# EasyEDA Pro project ProProject_Orin Adapter_2025-03-09.epro

# Schematic Schematic1
Create Date: 2024-01-20; Page Name: P1; Project Name: Orin Adapter; Schematic Name: Schematic1; Update Date: 2024-01-22; Company: EasyEDA.com; Drawed: EasyEDA Pro; Page Size: A4; Part Number: JLCPCB-002; Reviewed: EasyEDA Pro; Version: V0.1
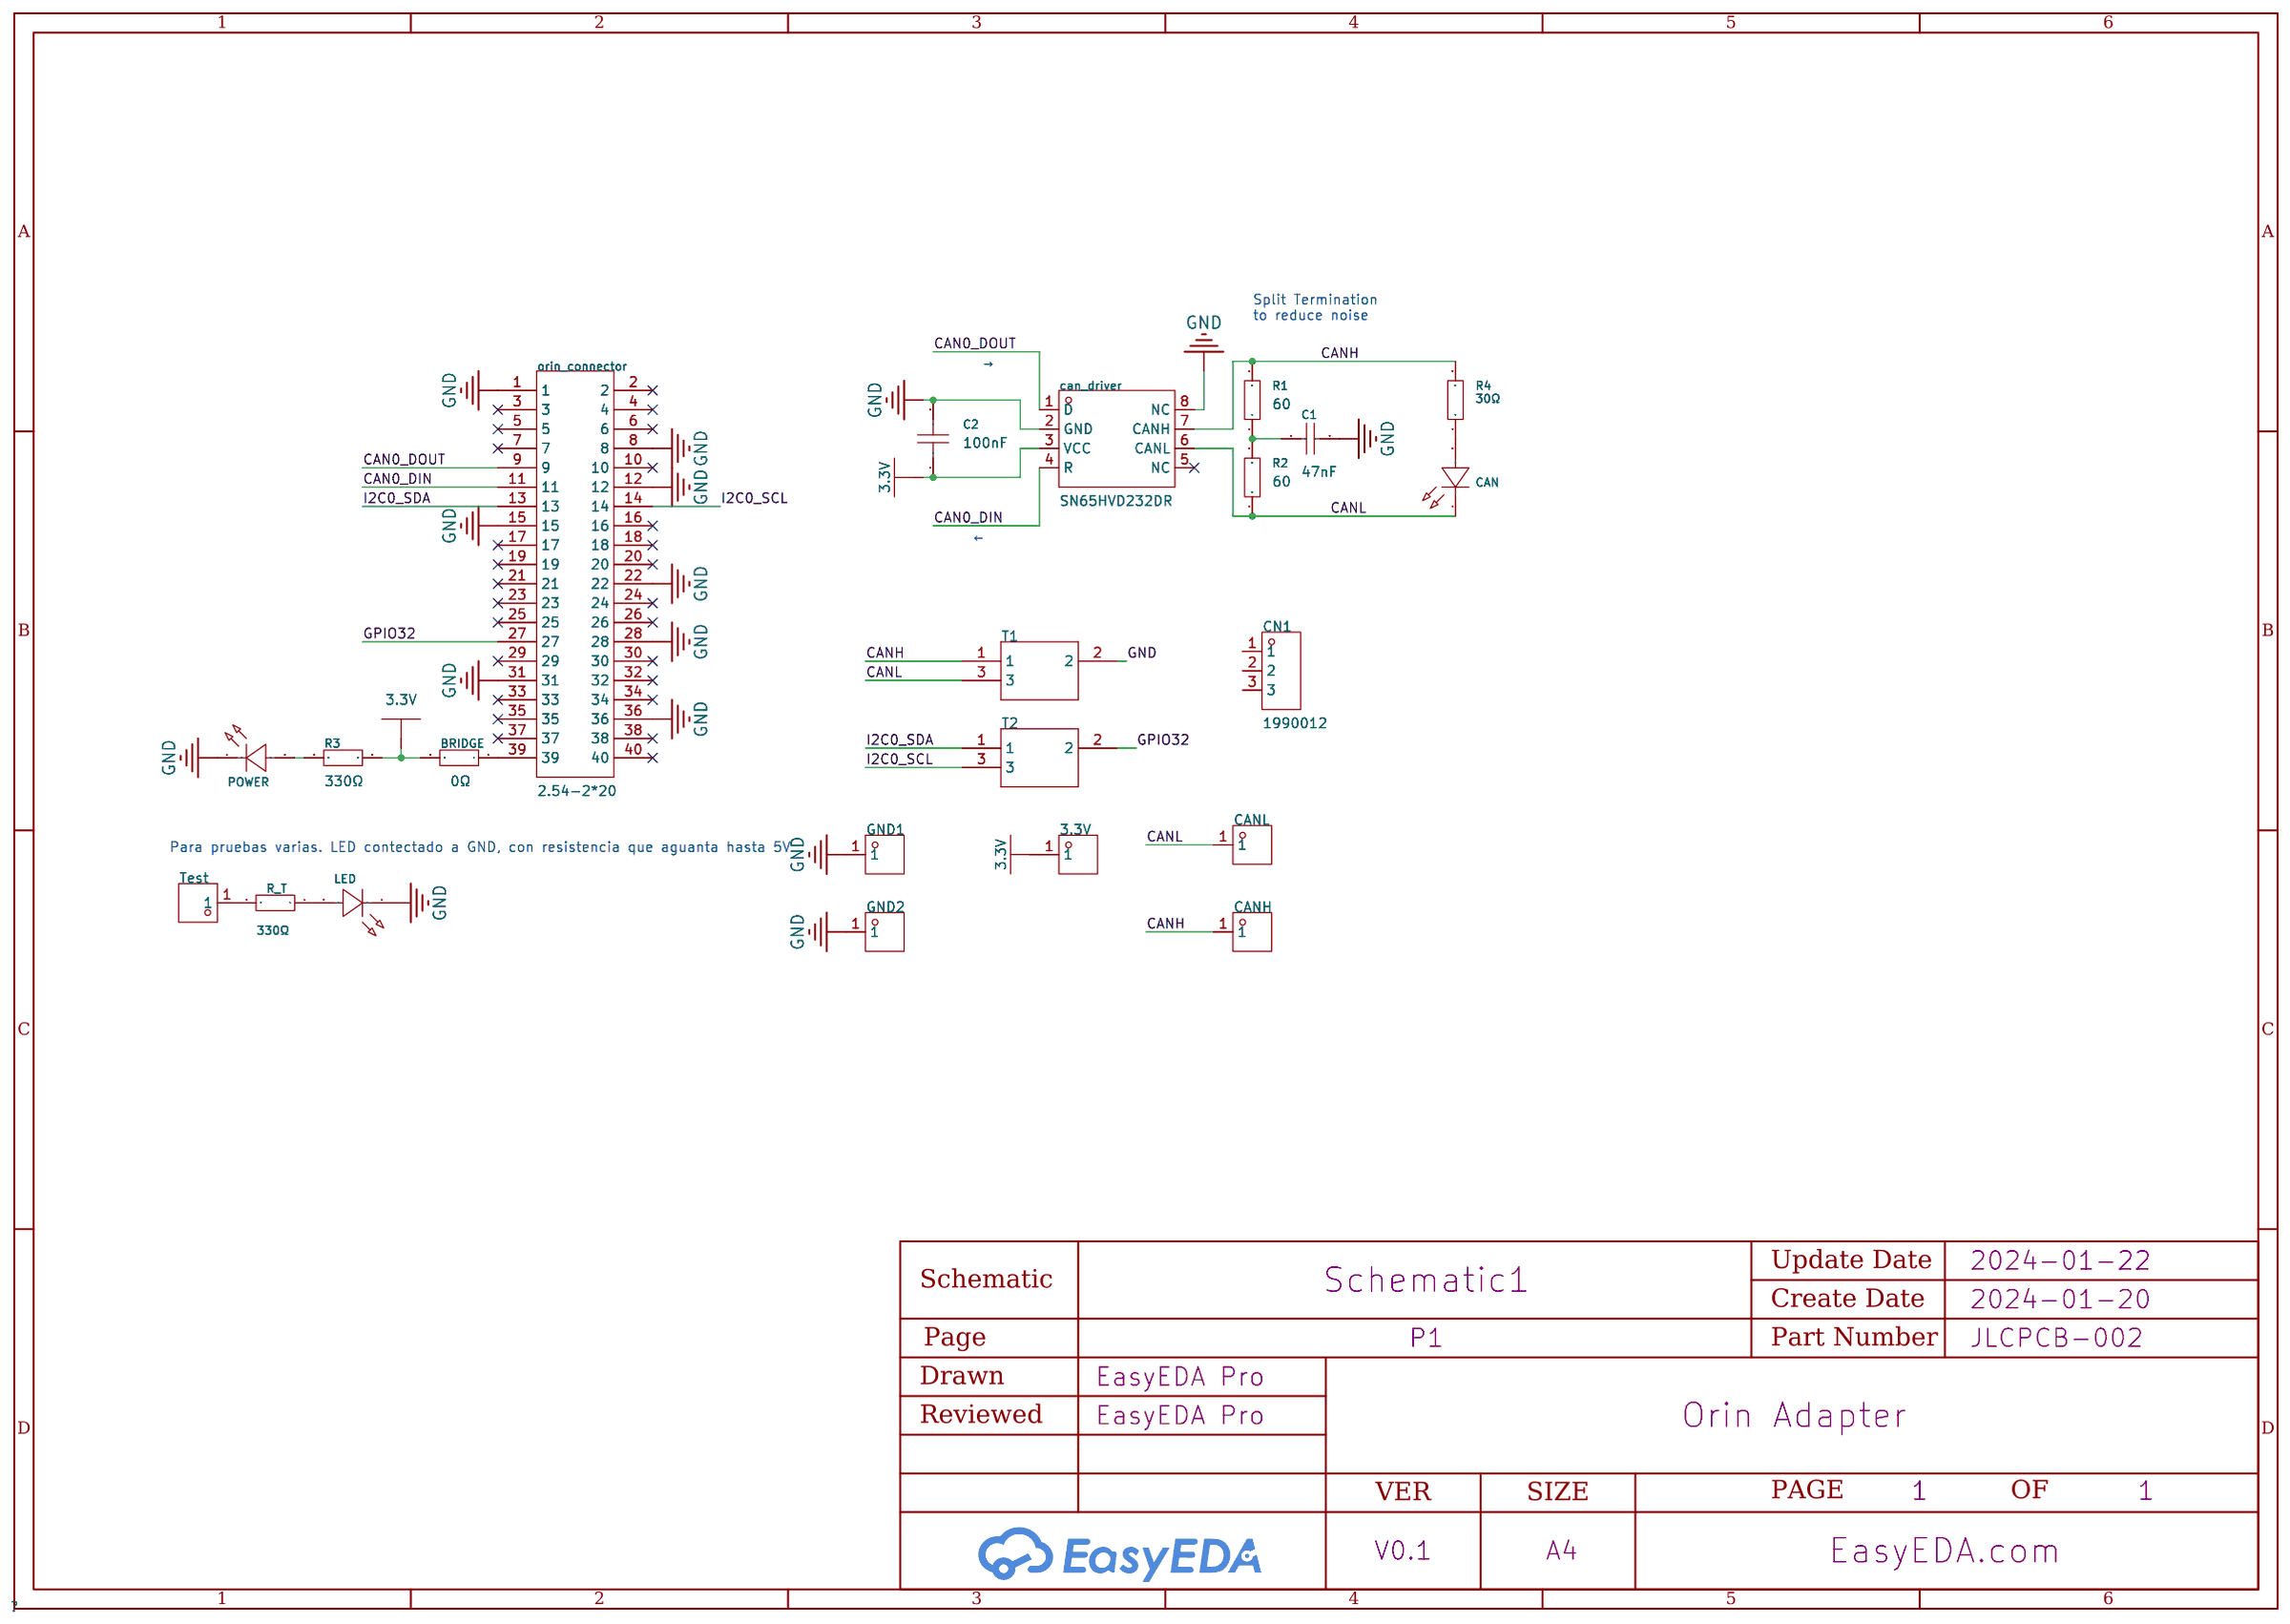
[diagram p0: schematic sheet]

## Parts
3.3V  5-146868-1  [HDR-TH_1P-P2.54-V-M_1]
BRIDGE  0Ω  [R0603]
C1  47nF  [C0603]
C2  100nF  [C0603]
CAN  150060GS75000  [LED0603-RD_GREEN]
can_driver  SN65HVD232DR  [SOIC-8_L5.0-W4.0-P1.27-LS6.0-BL]
CANH  5-146868-1  [HDR-TH_1P-P2.54-V-M_1]
CANL  5-146868-1  [HDR-TH_1P-P2.54-V-M_1]
CN1  1990012  [CONN-TH_3P-P2.50-S5.00_1990012]
GND1  5-146868-1  [HDR-TH_1P-P2.54-V-M_1]
GND2  5-146868-1  [HDR-TH_1P-P2.54-V-M_1]
LED  150060GS75000  [LED0603-RD_GREEN]
orin_connector  2.54-2*20  [HDR-TH_40P-P2.54-V-F-R2-C20-S2.54]
POWER  150060GS75000  [LED0603-RD_GREEN]
R1  60  [R0603]
R2  60  [R0603]
R3  330Ω  [R0603]
R4  30Ω  [R0603]
R_T  330Ω  [R0603]
T1  -  [1990012]
T2  -  [1990012]
Test  5-146868-1  [HDR-TH_1P-P2.54-V-M_1]

## Library data of the parts
3.3V CANH CANL GND1 GND2 Test = 5-146868-1: Pin Structure:- Pitch:2.54mm Row Spacing:- Circluar Pins/Square Pins:Square Pins Mounting Type:Straight Number of Rows:Plugin Current Rating (Max):3A Voltage Rating (Max):- Length of Mating Pin:5.84mm Insulation Height:2.54mm Length of End Connection Pin:; LCSC Part Name: 间距:2.54mm 直插 方针; Supplier Part: C429850; Manufacturer: TE Connectivity(泰科电子); Supplier Footprint: 插件,P=2.54mm; JLCPCB Part Class: Extended Part; Datasheet: https://atta.szlcsc.com/upload/public/pdf/source/20190918/C429850_A862E4FE2DA9F2465B1AD59242CB7807.pdf; Supplier: LCSC; Pitch: 2.54mm; Circluar Pins/Square Pins: Square Pins; Mounting Type: Straight; Number of Rows: Plugin; Current Rating (Max): 3A; Length of Mating Pin: 5.84mm; Insulation Height: 2.54mm; Length of End Connection Pin: 2.79mm; Contact Plating: Tin; Operating Temperature Range: -65℃~+105℃; Color: Black
BRIDGE = 0603WAF0000T5E: Resistance: Tolerance:±1% Tolerance:±1% Power(Watts): Overload Voltage (Max): Type:Thick Film Resistors Operating Temperature Range:-55℃~+155℃ Operating Temperature Range:-55℃~+155℃; LCSC Part Name: 0Ω ±1% 100mW 厚膜电阻; Supplier Part: C21189; Manufacturer: UNI-ROYAL(厚声); Supplier Footprint: 0603; JLCPCB Part Class: Basic Part; Datasheet: https://atta.szlcsc.com/upload/public/pdf/source/20200306/C422600_1E6D84923E4A46A82E41ADD87F860B5C.pdf; Supplier: LCSC; Tolerance: ±1%; Type: Thick Film Resistors; Operating Temperature Range: -55℃~+155℃
C1 = CC0603KRX7R9BB473: Capacitance: Tolerance:±10% Tolerance:±10% Voltage Rated: Temperature Coefficient:; LCSC Part Name: 47nF ±10% 50V; Supplier Part: C107093; Manufacturer: YAGEO(国巨); Supplier Footprint: 0603; JLCPCB Part Class: Extended Part; Datasheet: https://atta.szlcsc.com/upload/public/pdf/source/20180910/C282072_33301C7F631E79921B82A8DAC6BCC5B3.pdf; Supplier: LCSC; Tolerance: ±10%
C2 = CC0603MRY5V8BB104: Capacitance: Tolerance:±20% Tolerance:±20% Voltage Rated: Temperature Coefficient:; LCSC Part Name: 100nF ±20% 25V; Supplier Part: C519502; Manufacturer: YAGEO(国巨); Supplier Footprint: 0603; JLCPCB Part Class: Extended Part; Datasheet: https://atta.szlcsc.com/upload/public/pdf/source/20200423/C519502_4FD98BCC5F534CB95D9F0050EEBAF7AA.pdf; Supplier: LCSC; Tolerance: ±20%
CAN LED POWER = 150060GS75000: Emitted Color:Emerald Lens Color:无色透明 Dominant Wavelength:520nm Dominant Wavelength:520nm Peak Wavelength:515nm Forward Current:20mA Forward Voltage (VF):3.2V Forward Voltage (VF):3.2V Luminous Intensity:430mcd Luminous Intensity:430mcd Viewing Angle:140°; Supplier Part: C5252984; Manufacturer: Wurth(伍尔特); Supplier Footprint: LED0603; JLCPCB Part Class: Extended Part; Datasheet: https://atta.szlcsc.com/upload/public/pdf/source/20230606/95151128D965C7A59E0D364CF71811DA.pdf; Supplier: LCSC; Emitted Color: Emerald; Lens Color: 无色透明; Dominant Wavelength: 520nm; Peak Wavelength: 515nm; Forward Current: 20mA; Forward Voltage (VF): 3.2V; Luminous Intensity: 430mcd; Viewing Angle: 140°
can_driver = SN65HVD232DR: Type:Transceiver Data Rate:1Mbps Supply Voltage:3V~3.6V Supply Voltage:3V~3.6V; Supplier Part: C30530; Manufacturer: TI(德州仪器); Supplier Footprint: SOIC-8; JLCPCB Part Class: Extended Part; Datasheet: https://atta.szlcsc.com/upload/public/pdf/source/20140507/1457707053094.pdf; Supplier: LCSC; Type: Transceiver; Data Rate: 1Mbps; Supply Voltage: 3V~3.6V
CN1 = 1990012: Supplier Part: C9900080101; Supplier Footprint: 3P; Supplier: LCSC
orin_connector = 2.54-2*20: Holes Structure:2x20P Pitch:2.54mm Row Spacing:2.54mm Circular Hole / Square Hole:Square Holes Mounting Type:Straight Number of Rows:双排 Number of Holes:40P Current Rating (Max):2.5A Voltage Rating (Max):- Holes Direction:Top Insulation Height:8.5mm Operat; LCSC Part Name: 间距:2.54mm 2x20P 直插; Supplier Part: C2977589; Manufacturer: ZHOURI(洲日); Supplier Footprint: 插件,P=2.54mm; JLCPCB Part Class: Extended Part; Datasheet: https://atta.szlcsc.com/upload/public/pdf/source/20220328/834E302BE3C038BBC5C70F5E02589B1E.pdf; Supplier: LCSC; Holes Structure: 2x20P; Pitch: 2.54mm; Row Spacing: 2.54mm; Circular Hole / Square Hole: Square Holes; Mounting Type: Straight; Number of Rows: 双排; Number of Holes: 40P; Current Rating (Max): 2.5A; Holes Direction: Top; Insulation Height: 8.5mm; Operating Temperature Range: -40℃~+105℃
R1 R2 = 0603WAF1002T5E: Type:Thick Film Resistors Resistance:10000Ω Tolerance:±1% Tolerance:±1% Power(Watts): Overload Voltage (Max): Temperature Coefficient:±100ppm/℃ Temperature Coefficient:±100ppm/℃ Operating Temperature Range:-55℃~+155℃ Operating Temperature Range:-55℃~+155℃; LCSC Part Name: 10kΩ ±1% 100mW 厚膜电阻; Supplier Part: C25804; Manufacturer: UNI-ROYAL(厚声); Supplier Footprint: 0603; JLCPCB Part Class: Basic Part; Datasheet: https://atta.szlcsc.com/upload/public/pdf/source/20200306/C422600_1E6D84923E4A46A82E41ADD87F860B5C.pdf; Supplier: LCSC; Type: Thick Film Resistors; Tolerance: ±1%; Temperature Coefficient: ±100ppm/℃; Operating Temperature Range: -55℃~+155℃
R3 R4 R_T = 0603WAF3300T5E: Resistance: Tolerance:±1% Tolerance:±1% Power(Watts): Overload Voltage (Max): Temperature Coefficient:±100ppm/℃ Temperature Coefficient:±100ppm/℃ Type:Thick Film Resistors Operating Temperature Range:-55℃~+155℃ Operating Temperature Range:-55℃~+155℃; LCSC Part Name: 330Ω ±1% 100mW 厚膜电阻; Supplier Part: C23138; Manufacturer: UNI-ROYAL(厚声); Supplier Footprint: 0603; JLCPCB Part Class: Basic Part; Datasheet: https://atta.szlcsc.com/upload/public/pdf/source/20200306/C422600_1E6D84923E4A46A82E41ADD87F860B5C.pdf; Supplier: LCSC; Tolerance: ±1%; Temperature Coefficient: ±100ppm/℃; Type: Thick Film Resistors; Operating Temperature Range: -55℃~+155℃
T1 T2 = 1990012_

## Nets
3.3V: 3.3V.1 BRIDGE.2 C2.1 can_driver.3(VCC) R3.2
3.3V_SOURCE: BRIDGE.1 orin_connector.39
GND: C1.2 C2.2 can_driver.2(GND) can_driver.8(NC) GND1.1 GND2.1 LED.1(K) orin_connector.1 orin_connector.8 orin_connector.12 orin_connector.15 orin_connector.22 orin_connector.28 orin_connector.31 orin_connector.36 POWER.1(K) T1.2
CAN0_DIN: can_driver.4(R) orin_connector.11
CAN0_DOUT: can_driver.1(D) orin_connector.9
CANH: can_driver.7(CANH) CANH.1 R1.2 R4.2 T1.1
CANL: CAN.1(K) can_driver.6(CANL) CANL.1 R2.1 T1.3
GPIO32: orin_connector.27 T2.2
I2C0_SCL: orin_connector.14 T2.3
I2C0_SDA: orin_connector.13 T2.1
$1N1022: C1.1 R1.1 R2.2
$1N1340: POWER.2(A) R3.1
$1N3192: CAN.2(A) R4.1
$1N3335: R_T.2 Test.1
$1N3337: LED.2(A) R_T.1

Not connected (* = marked no-connect by the designer): can_driver 5(NC)*; CN1 1 2 3; orin_connector 2* 3* 4* 5* 6* 7* 10* 16* 17* 18* 19* 20* 21* 23* 24* 25* 26* 29* 30* 32* 33* 34* 35* 37* 38* 40*

## Notes on the sheet
- Split Termination
  to reduce noise
- →
- ←
- Para pruebas varias. LED contectado a GND, con resistencia que aguanta hasta 5V

# Board PCB1
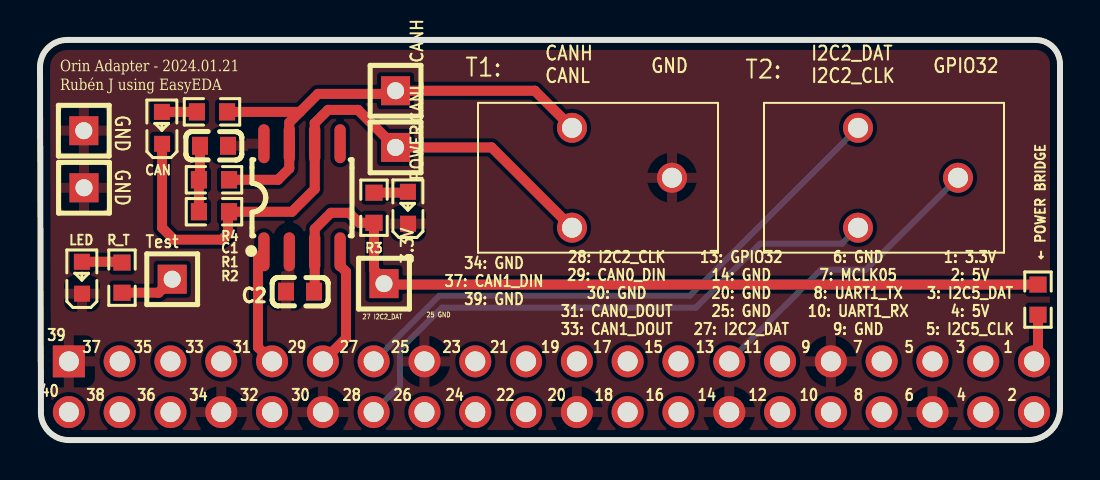
[diagram p1: board, top side]
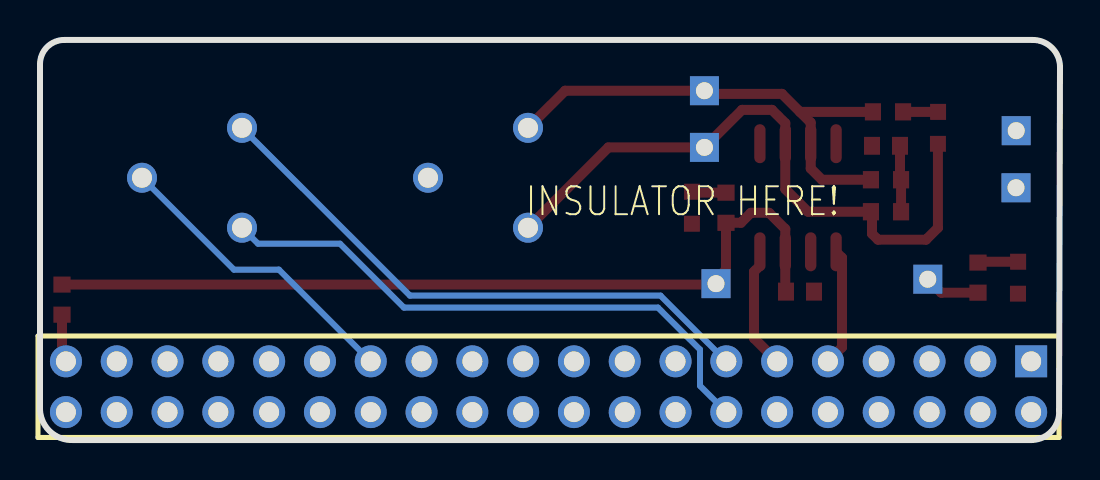
[diagram p2: board, bottom side, seen from below]

Outline 51 x 20.03 mm; copper layers: Top Layer, Bottom Layer. Coordinates in mm from the lower left corner of the outline.
Outline path: 0,18.67 0.05,1.49 arc(0.41,0.46) 1.4,0 49.34,0 arc(50.54,0.46) 51,1.66 51,18.82 arc(50.65,19.68) 49.79,20.03 1.36,20.03 arc(0.4,19.63) 0,18.67
Stack: Top Layer 0.035mm / Dielectric1 1.51mm FR4 er 4.5 / Bottom Layer 0.035mm

## Design rules (mm)
template: Custom Config
spacing copperThickness1oz (default): track to track 0.102, other pairs 0.152 to 0.3
spacing copperThickness2oz: track to track 0.203, other pairs 0.152 to 0.3
track width copperThickness1oz (default): min 0.127, default 0.254, max 2.54
track width copperThickness2oz: min 0.203, default 0.254, max 2.54
differential pair differentialPair (default): width min 0.127, default 0.254, max 2.54; gap min 0.152, default 0.152
via viaSize (default): diameter min 0.5, default 0.61, max 10; hole min 0.3, default 0.305, max 6.3

## Placement (name value [footprint] x y rotation side)
3.3V  5-146868-1  [HDR-TH_1P-P2.54-V-M_1]  17.2 7.83 0 top
C1  47nF  [C0603]  8.7 14.73 0 top
C2  100nF  [C0603]  13 7.43 180 top
CAN  150060GS75000  [LED0603-RD_GREEN]  6.1 15.63 90 top
can_driver  SN65HVD232DR  [SOIC-8_L5.0-W4.0-P1.27-LS6.0-BL]  13.1 12.13 0 top
CANH  5-146868-1  [HDR-TH_1P-P2.54-V-M_1]  17.78 17.49 0 top
CANL  5-146868-1  [HDR-TH_1P-P2.54-V-M_1]  17.78 14.65 0 top
GND1  5-146868-1  [HDR-TH_1P-P2.54-V-M_1]  2.2 12.63 0 top
GND2  5-146868-1  [HDR-TH_1P-P2.54-V-M_1]  2.19 15.49 0 top
LED  150060GS75000  [LED0603-RD_GREEN]  2.1 8.13 90 top
orin_connector  2.54-2*20  [HDR-TH_40P-P2.54-V-F-R2-C20-S2.54]  25.57 2.67 0 bottom
POWER  150060GS75000  [LED0603-RD_GREEN]  18.4 11.63 90 top
R1  60  [R0603]  8.7 13.03 0 top
R2  60  [R0603]  8.7 11.43 180 top
R3  330Ω  [R0603]  16.7 11.63 270 top
R4  30Ω  [R0603]  8.6 16.43 0 top
R_T  330Ω  [R0603]  4.1 8.13 270 top
T1:  -  [1990012]  27.9 13.13 270 top
T2:  -  [1990012]  42.2 13.13 270 top
Test  5-146868-1  [HDR-TH_1P-P2.54-V-M_1]  6.61 8.05 0 top
← POWER BRIDGE  0Ω  [R0603]  49.9 7.03 90 top

## Footprints (pads in the part's own frame, mm; a bottom-side part is the same pattern mirrored in y, then rotated)
1990012
  round 1.5 hole 1: 1(-2.5,-1.3) 2(0,3.7) 3(2.5,-1.3)
C0603
  rect 0.8x0.9 smd: 1(-0.7,0) 2(0.7,0)
HDR-TH_1P-P2.54-V-M_1
  rect 1.45x1.45 hole 0.85: 1(0,0)
HDR-TH_40P-P2.54-V-F-R2-C20-S2.54
  rect 1.6x1.6 hole 1: 1(-24.13,-1.27)
  round 1.6 hole 1: 2(-24.13,1.27) 3(-21.59,-1.27) 4(-21.59,1.27) 5(-19.05,-1.27) 6(-19.05,1.27) 7(-16.51,-1.27) 8(-16.51,1.27) 9(-13.97,-1.27) 10(-13.97,1.27) 11(-11.43,-1.27) 12(-11.43,1.27) 13(-8.89,-1.27) 14(-8.89,1.27) 15(-6.35,-1.27) 16(-6.35,1.27) 17(-3.81,-1.27) 18(-3.81,1.27) 19(-1.27,-1.27) 20(-1.27,1.27) 21(1.27,-1.27) 22(1.27,1.27) 23(3.81,-1.27) 24(3.81,1.27) 25(6.35,-1.27) 26(6.35,1.27) 27(8.89,-1.27) 28(8.89,1.27) 29(11.43,-1.27) 30(11.43,1.27) 31(13.97,-1.27) 32(13.97,1.27) 33(16.51,-1.27) 34(16.51,1.27) 35(19.05,-1.27) 36(19.05,1.27) 37(21.59,-1.27) 38(21.59,1.27) 39(24.13,-1.27) 40(24.13,1.27)
LED0603-RD_GREEN
  rect 0.8x0.8 smd: 1(-0.799,-0.004) 2(0.799,0.004)
R0603
  rect 0.806x0.864 smd: 1(-0.753,0) 2(0.753,0)
SOIC-8_L5.0-W4.0-P1.27-LS6.0-BL
  oval 0.569x1.95 smd: 1(-1.905,-2.705) 2(-0.635,-2.705) 3(0.635,-2.705) 4(1.905,-2.705) 5(1.905,2.705) 6(0.635,2.705) 7(-0.635,2.705) 8(-1.905,2.705)

## Nets
3.3V: 3.3V.1 C2.1 can_driver.3 R3.2 ← POWER BRIDGE.2
3.3V_SOURCE: orin_connector.39 ← POWER BRIDGE.1
GND: C1.2 C2.2 can_driver.2 can_driver.8 GND1.1 GND2.1 LED.1 orin_connector.1 orin_connector.8 orin_connector.12 orin_connector.15 orin_connector.22 orin_connector.28 orin_connector.31 orin_connector.36 POWER.1 T1:.2
CAN0_DIN: can_driver.4 orin_connector.11
CAN0_DOUT: can_driver.1 orin_connector.9
CANH: can_driver.7 CANH.1 R1.2 R4.2 T1:.1
CANL: CAN.1 can_driver.6 CANL.1 R2.1 T1:.3
GPIO32: orin_connector.27 T2:.2
I2C0_SCL: orin_connector.14 T2:.3
I2C0_SDA: orin_connector.13 T2:.1
$1N1022: C1.1 R1.1 R2.2
$1N1340: POWER.2 R3.1
$1N3192: CAN.2 R4.1
$1N3335: R_T.2 Test.1
$1N3337: LED.2 R_T.1

Pads without a net: can_driver 5; orin_connector 2 3 4 5 6 7 10 16 17 18 19 20 21 23 24 25 26 29 30 32 33 34 35 37 38 40

## Routing (per net, layer and track width the routed paths; a pad name or vN(x,y) marks a point on that pad's centre or on a via; arc(x,y) is an arc through that point)
3.3V: length 42.5
  Top Layer w0.5: C2.1 13.73,7.46 can_driver.3 13.73,10.56 14.55,11.38 15.45,11.38 15.95,10.88 R3.2 16.7,8.53 17.45,7.78 ← POWER BRIDGE.2
3.3V_SOURCE: length 2.4
  Top Layer w0.5: ← POWER BRIDGE.1 49.9,4.14 orin_connector.39
CAN0_DIN: length 6.1
  Top Layer w0.5: can_driver.4 15,8.72 15.3,8.43 15.3,5.1 orin_connector.11
CAN0_DOUT: length 5.9
  Top Layer w0.5: can_driver.1 10.9,9.13 10.9,4.64 orin_connector.9
CANH: length 24.8
  Top Layer w0.5: 13,16.43 12.47,15.89 can_driver.7 12.47,13.59 11.9,13.03 R1.2 ; 13,16.43 13.9,17.33 17.62,17.33 CANH.1 24.74,17.49 T1:.1 ; 13,16.43 R4.2
CANL: length 32.6
  Top Layer w0.5: T1:.3 22.58,14.65 CANL.1 15.9,16.53 14.4,16.53 13.73,15.86 can_driver.6 13.73,12.56 12.6,11.43 R2.1 9.4,11.38 9.4,10.33 9.1,10.03 6.7,10.03 6.1,10.63 CAN.1
GPIO32: length 15.2
  Bottom Layer w0.3: orin_connector.27 39.05,8.53 41.3,8.53 T2:.2
I2C0_SCL: length 29.1
  Bottom Layer w0.3: T2:.3 40.1,9.83 36,9.83 32.8,6.63 20.1,6.63 18,4.53 18,2.72 orin_connector.14
I2C0_SDA: length 29.1
  Bottom Layer w0.3: T2:.1 32.5,7.23 19.97,7.23 orin_connector.13
$1N1022: length 3.3
  Top Layer w0.5: R2.2 R1.1 8,13.08 C1.1
$1N1340: length 1.7
  Top Layer w0.5: R3.1 18.35,12.38 POWER.2
$1N3192: length 1.7
  Top Layer w0.5: CAN.2 R4.1
$1N3335: length 2.8
  Top Layer w0.5: R_T.2 5.94,7.38 Test.1
$1N3337: length 2
  Top Layer w0.5: R_T.1 4.06,8.93 LED.2

## Copper pours and planes (outline as drawn; the poured copper is in the pictures)
GND on Top Layer: 0.02,20.03 51.02,20.03 51.02,0.03 0.02,0.03

## Text on the board
Bottom Silkscreen Layer: INSULATOR HERE!
Top Silkscreen Layer: 27 I2C2_DAT | 25 GND | 39 | 34: GND / 37: CAN1_DIN / 39: GND | 28: I2C2_CLK / 29: CAN0_DIN / 30: GND / 31: CAN0_DOUT / 33: CAN1_DOUT | 13: GPIO32 / 14: GND / 20: GND / 25: GND / 27: I2C2_DAT | 6: GND / 7: MCLK05 / 8: UART1_TX / 10: UART1_RX / 9: GND | 1: 3.3V / 2: 5V / 3: I2C5_DAT / 4: 5V / 5: I2C5_CLK | 40 | 37 | 38 | 35 | 36 | 33 | 34 | 31 | 32 | 29 | 30 | 27 | 28 | 25 | 26 | 23 | 24 | 21 | 22 | 19 | 20 | 17 | 18 | 15 | 16 | 13 | 14 | 11 | 12 | 9 | 10 | 7 | 8 | 5 | 6 | 3 | 4 | 1 | 2 | CANH / CANL | GND | I2C2_DAT / I2C2_CLK | GPIO32 | Orin Adapter - 2024.01.21 / Rubén J using EasyEDA
